# Altium schematic sheet 04.MOSFET.SchDoc: ARES_R30_Power
size A4; CompanyName: HIGEN; DrawnBy: 212084; Revision: V0.21; SheetNumber: 4; SheetTotal: 5; DrawingNumber: 임시도면
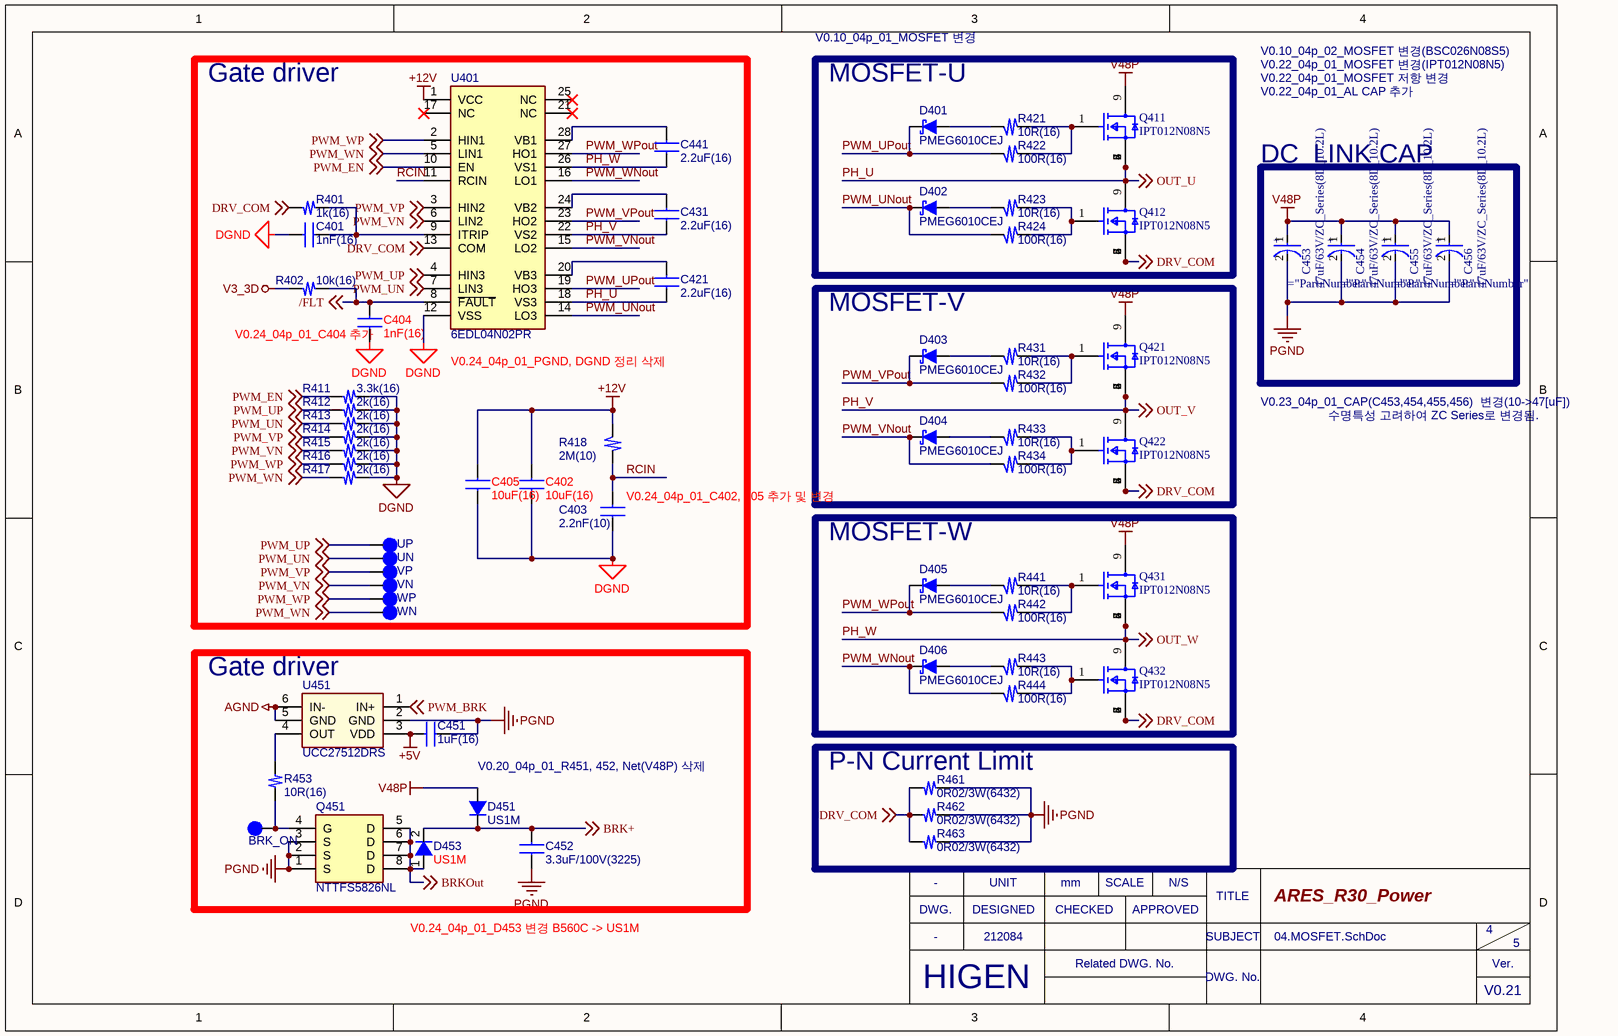
[diagram p0: 04.MOSFET.SchDoc]

## Parts
BRK_ON  TP  [TP-SMD]  (value not drawn)
C401  1nF(16)  [C-1608S]
C402  10uF(16)  [C-1608S]
C403  2.2nF(10)  [C-1005S]
C404  1nF(16)  [C-1608S]
C405  10uF(16)  [C-1608S]
C421  2.2uF(16)  [C-1608S]
C431  2.2uF(16)  [C-1608S]
C441  2.2uF(16)  [C-1608S]
C451  1uF(16)  [C-1608S]
C452  3.3uF/100V(3225)  [C-3225]
C453  47uF/63V/ZC_Series(8D_10.2L)  [EC-H10]
C454  47uF/63V/ZC_Series(8D_10.2L)  [EC-H10]
C455  47uF/63V/ZC_Series(8D_10.2L)  [EC-H10]
C456  47uF/63V/ZC_Series(8D_10.2L)  [EC-H10]
D401  PMEG6010CEJ  [SOD-323]
D402  PMEG6010CEJ  [SOD-323]
D403  PMEG6010CEJ  [SOD-323]
D404  PMEG6010CEJ  [SOD-323]
D405  PMEG6010CEJ  [SOD-323]
D406  PMEG6010CEJ  [SOD-323]
D451  US1M  [SMA]
D453  US1M  [SMA]
Q411  IPT012N08N5  [PG-HSOF-8-1]
Q412  IPT012N08N5  [PG-HSOF-8-1]
Q421  IPT012N08N5  [PG-HSOF-8-1]
Q422  IPT012N08N5  [PG-HSOF-8-1]
Q431  IPT012N08N5  [PG-HSOF-8-1]
Q432  IPT012N08N5  [PG-HSOF-8-1]
Q451  NTTFS5826NL  [WDFN-8]
R401  1k(16)  [R-1608S]
R402  10k(16)  [R-1608S]
R411  3.3k(16)  [R-1608S]
R412  2k(16)  [R-1608S]
R413  2k(16)  [R-1608S]
R414  2k(16)  [R-1608S]
R415  2k(16)  [R-1608S]
R416  2k(16)  [R-1608S]
R417  2k(16)  [R-1608S]
R418  2M(10)  [RES-1005S]
R421  10R(16)  [R-1608S]
R422  100R(16)  [R-1608S]
R423  10R(16)  [R-1608S]
R424  100R(16)  [R-1608S]
R431  10R(16)  [R-1608S]
R432  100R(16)  [R-1608S]
R433  10R(16)  [R-1608S]
R434  100R(16)  [R-1608S]
R441  10R(16)  [R-1608S]
R442  100R(16)  [R-1608S]
R443  10R(16)  [R-1608S]
R444  100R(16)  [R-1608S]
R453  10R(16)  [R-1608S]
R461  0R02/3W(6432)  [R-6432]
R462  0R02/3W(6432)  [R-6432]
R463  0R02/3W(6432)  [R-6432]
U401  6EDL04N02PR  [TSSOP-28]
U451  UCC27512DRS  [WSON-6]
UN  TP  [TP-SMD]  (value not drawn)
UP  TP  [TP-SMD]  (value not drawn)
VN  TP  [TP-SMD]  (value not drawn)
VP  TP  [TP-SMD]  (value not drawn)
WN  TP  [TP-SMD]  (value not drawn)
WP  TP  [TP-SMD]  (value not drawn)

## Blocks framed on the sheet
Gate driver: C401-C405 C421 C431 C441 R401 R402 R411-R418 U401 UN UP VN VP WN WP
MOSFET-U: D401 D402 Q411 Q412 R421-R424
DC_LINK CAP: C453-C456
MOSFET-V: D403 D404 Q421 Q422 R431-R434
MOSFET-W: D405 D406 Q431 Q432 R441-R444
Gate driver: BRK_ON C451 C452 D451 D453 Q451 R453 U451
P-N Current Limit: R461-R463

## Nets
+5V: C451.1 U451.3(VDD)
+12V: C402.1 C405.1 R418.2 U401.1(VCC)
AGND: U451.5(GND) U451.6(IN-)
DGND: C401.1 C402.2 C403.1 C404.1 C405.2 R411.2(P2) R412.1(P1) R413.1(P1) R414.1(P1) R415.1(P1) R416.2(P2) R417.2(P2) U401.12(VSS)
PGND: C451.2 C452.1 C453.2(A) C454.2(A) C455.2(A) C456.2(A) Q451.1(S) Q451.2(S) Q451.3(S) R461.1(P1) R462.1(P1) R463.1(P1) U451.2(GND)
V3_3D: R402.1(P1)
V48P: C453.1(C) C454.1(C) C455.1(C) C456.1(C) D451.1(A) Q411.9(Drain) Q421.9(Drain) Q431.9(Drain)
/FLT: C404.2 R402.2(P2) U401.8(~{FAULT}) ; off-sheet /FLT
BRK+: C452.2 D451.2(K) D453.2(K) ; off-sheet BRK+
BRKOut: D453.1(A) Q451.5(D) Q451.6(D) Q451.7(D) Q451.8(D) ; off-sheet BRKOut
DRV_COM: Q412.2(Source) Q412.3(Source) Q412.4(Source) Q412.5(Source) Q412.6(Source) Q412.7(Source) Q412.8(Source) Q422.2(Source) Q422.3(Source) Q422.4(Source) Q422.5(Source) Q422.6(Source) Q422.7(Source) Q422.8(Source) Q432.2(Source) Q432.3(Source) Q432.4(Source) Q432.5(Source) Q432.6(Source) Q432.7(Source) Q432.8(Source) R401.1(P1) R461.2(P2) R462.2(P2) R463.2(P2) U401.13(COM) ; off-sheet DRV_COM
PH_U: C421.2 Q411.2(Source) Q411.3(Source) Q411.4(Source) Q411.5(Source) Q411.6(Source) Q411.7(Source) Q411.8(Source) Q412.9(Drain) U401.18(VS3) ; off-sheet OUT_U  [also labelled OUT_U]
PH_V: C431.1 Q421.2(Source) Q421.3(Source) Q421.4(Source) Q421.5(Source) Q421.6(Source) Q421.7(Source) Q421.8(Source) Q422.9(Drain) U401.22(VS2) ; off-sheet OUT_V  [also labelled OUT_V]
PH_W: C441.1 Q431.2(Source) Q431.3(Source) Q431.4(Source) Q431.5(Source) Q431.6(Source) Q431.7(Source) Q431.8(Source) Q432.9(Drain) U401.26(VS1) ; off-sheet OUT_W  [also labelled OUT_W]
PWM_BRK: U451.1(IN+) ; off-sheet PWM_BRK
PWM_EN: R411.1(P1) U401.10(EN) ; off-sheet PWM_EN
PWM_UN: R413.2(P2) U401.7(LIN3) UN.1 ; off-sheet PWM_UN
PWM_UNout: D402.2(K) R424.2 U401.14(LO3)
PWM_UP: R412.2(P2) U401.4(HIN3) UP.1 ; off-sheet PWM_UP
PWM_UPout: D401.2(K) R422.2 U401.19(HO3)
PWM_VN: R415.2(P2) U401.6(LIN2) VN.1 ; off-sheet PWM_VN
PWM_VNout: D404.2(K) R434.2 U401.15(LO2)
PWM_VP: R414.2(P2) U401.3(HIN2) VP.1 ; off-sheet PWM_VP
PWM_VPout: D403.2(K) R432.2 U401.23(HO2)
PWM_WN: R417.1(P1) U401.5(LIN1) WN.1 ; off-sheet PWM_WN
PWM_WNout: D406.2(K) R444.2 U401.16(LO1)
PWM_WP: R416.1(P1) U401.2(HIN1) WP.1 ; off-sheet PWM_WP
PWM_WPout: D405.2(K) R442.2 U401.27(HO1)
RCIN: C403.2 R418.1 U401.11(RCIN)
NetBRK_ON_1: BRK_ON.1 Q451.4(G) R453.1(P1)
NetC401_2: C401.2 R401.2(P2) U401.9(ITRIP)
NetC421_1: C421.1 U401.20(VB3)
NetC431_2: C431.2 U401.24(VB2)
NetC441_2: C441.2 U401.28(VB1)
NetD401_1: D401.1(A) R421.2
NetD402_1: D402.1(A) R423.2
NetD403_1: D403.1(A) R431.2
NetD404_1: D404.1(A) R433.2
NetD405_1: D405.1(A) R441.2
NetD406_1: D406.1(A) R443.2
NetQ411_1: Q411.1(Gate) R421.1 R422.1
NetQ412_1: Q412.1(Gate) R423.1 R424.1
NetQ421_1: Q421.1(Gate) R431.1 R432.1
NetQ422_1: Q422.1(Gate) R433.1 R434.1
NetQ431_1: Q431.1(Gate) R441.1 R442.1
NetQ432_1: Q432.1(Gate) R443.1 R444.1
NetR453_2: R453.2(P2) U451.4(OUT)

Not connected (* = marked no-connect by the designer): U401 17(NC)* 21(NC)* 25(NC)*

## Notes on the sheet
- V0.10_04p_01_MOSFET 변경
- V0.10_04p_02_MOSFET 변경(BSC026N08S5)
- V0.22_04p_01_MOSFET 변경(IPT012N08N5)
- V0.22_04p_01_MOSFET 저항 변경
- V0.22_04p_01_AL CAP 추가
- (near C404) V0.24_04p_01_C404 추가
- (near U401) V0.24_04p_01_PGND, DGND 정리 삭제
- V0.23_04p_01_CAP(C453,454,455,456)  변경(10->47[uF])
- 수명특성 고려하여 ZC Series로 변경됨.
- (near C403) V0.24_04p_01_C402, 405 추가 및 변경
- (near D451) V0.20_04p_01_R451, 452, Net(V48P) 삭제
- V0.24_04p_01_D453 변경 B560C -> US1M
- -
- DWG.
- UNIT
- DESIGNED
- mm
- CHECKED
- SCALE
- APPROVED
- N/S
- TITLE
- HIGEN
- Related DWG. No.
- SUBJECT
- DWG. No.
- Ver.
- (in symbol EEE-FK1J680UP) +

## Library data of the parts
BRK_ON UN UP VN VP WN WP = 2H_TestPointThroughHole: Mfr: Keystone Electronics; MfrNum: 5002; TIIntPartnumber: 2H0026; DescriptiveText: Testpoint Miniature Through Hole; Vendor: Digikey; Cost100: 0.163; Cost10K: 0.10; PartName: TestPointThroughHole
C401-C405 C421 C431 C441 C452 = CAP_NP
C451 = Cap_NP
C453-C456 = EEE-FK1J680UP
D401-D406 = Diode_schottky
D451 D453 = Diode
Q411 Q412 Q421 Q422 Q431 Q432 = IAUT300N08S5N012ATMA2: TRANS 80V 300A 1.2MOHM TOLL; Manufacturer: Infineon; Automotive Grade: Grade 0; Depletion Mode: False; Drain To Source Resistance: 1mΩ; Gate Charge At Vgs: 178nC @ 10V; Gate To Source Voltage: 20V; Input Capacitace At Vds: 12500pF @ 40V; Max Forward Diode Voltage: 1.2V; Max Junction Temp: +175°C; Number Of Channels: 1; Power Dissipation: 375W; Pulse Drain Current: 1200A; Reverse Recovery Charge: 177nC; Reverse Recovery Time: 86ns; Threshold Vgs Max: 3.8V; Threshold Vgs Min: 2.2V; Turn Off Delay Time: 69ns; Turn On Delay Time: 31ns; Typ Forward Diode Voltage: 0.9V; Verification Version: 0.0.0.3; Datasheet Path: datasheets/Trans_Infineon_IAUT300N08S5N012ATMA2_eec.pdf; Automotive: Yes; ComponentLink1Description: Upverter; ComponentLink1URL: https://upverter.com/part/id/5247eac4253ea04b/; ComponentLink2Description: Datasheet; ComponentLink2URL: https://www.infineon.com/dgdl/Infineon-IAUT300N08S5N012-DS-v01_00-EN.pdf?fileId=5546d46258fc0bc10158fdabe0f90580; Continuous Drain Current: 300A; Digikey Description: TRANS 80V 300A 1.2MOHM TOLL; Digikey Part Number: IAUT300N08S5N012ATMA2CT-ND; Drain To Source Breakdown Voltage: 80V; Drain To Source Voltage: 80V; Footprint Url: https://www.infineon.com/cms/en/product/packages/PG-HSOF/PG-HSOF-8-1/; Height: 2.4mm; Lead Free: Yes; Mouser Description: Trans MOSFET N-CH 80V 300A Automotive 9-Pin(8+Tab) HSOF T/R; Mouser Part Number: 726-IAUT300N08S5N012; Number Of N Channels: 1; Package: PG-HSOF-8; Part Number: IAUT300N08S5N012ATMA2; RoHS: TRUE; Supplier 1: Digi-Key; Supplier 2: Mouser; Supplier Part Number 1: IAUT300N08S5N012ATMA2CT-ND; Supplier Part Number 2: 726-IAUT300N08S5N012; Temperature: -55°C to +175°C; Temperature Range High: +175°C; Temperature Range Low: -55°C; helpURL: https://upverter.com/part/id/5247eac4253ea04b/
R401 R402 R411-R418 R421-R424 R431-R434 R441-R444 R453 R461-R463 = Res